# EAGLE design 4ButtonSwitch.Rev1 (EAGLE 8.6.0)
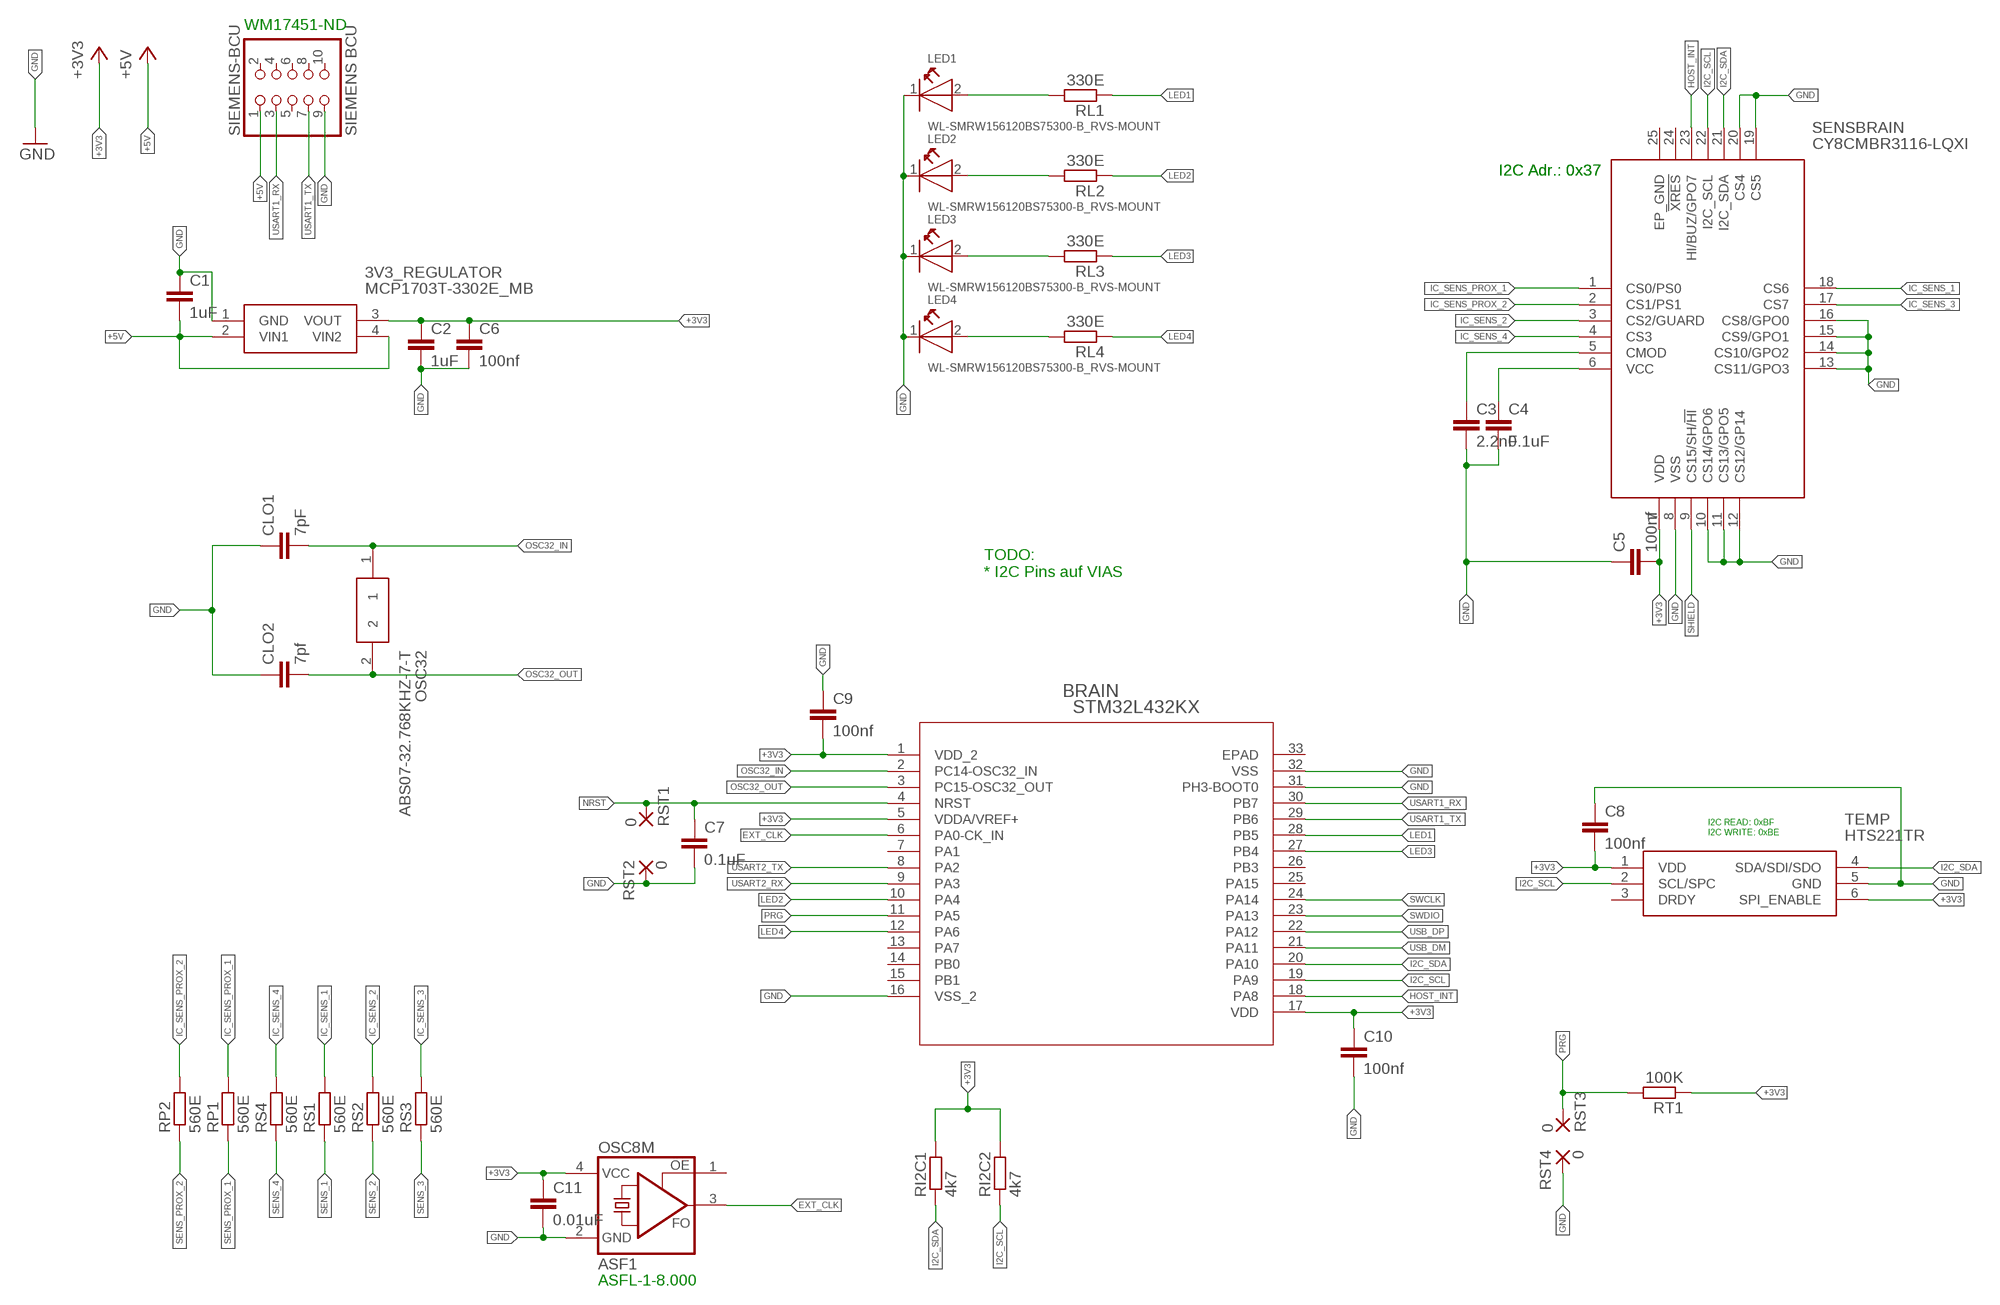
[diagram p0: schematic, sheet 1]

## Parts
3V3_REGULATOR  MCP1703T-3302E_MB  [SOT-89(MB)]
BRAIN  STM32L432KX  [UFQFPN32-5X5MM]
C1  1uF  C-EUC0402  [C0402]
C2  1uF  C-EUC0402  [C0402]
C3  2.2nF  C-EUC0402  [C0402]
C4  0.1uF  C-EUC0402  [C0402]
C5  100nf  C-EUC0402  [C0402]
C6  100nf  C-EUC0402  [C0402]
C7  0.1uF  C-EUC0402  [C0402]
C8  100nf  C-EUC0402  [C0402]
C9  100nf  C-EUC0402  [C0402]
C10  100nf  C-EUC0402  [C0402]
C11  0.01uF  C-EUC0402  [C0402]
CLO1  7pF  C-EUC0402  [C0402]
CLO2  7pf  C-EUC0402  [C0402]
LED1  WL-SMRW156120BS75300-B_RVS-MOUNT  [WL-SMRW-1206-CYLDR-REVERSE-MOUNT]
LED2  WL-SMRW156120BS75300-B_RVS-MOUNT  [WL-SMRW-1206-CYLDR-REVERSE-MOUNT]
LED3  WL-SMRW156120BS75300-B_RVS-MOUNT  [WL-SMRW-1206-CYLDR-REVERSE-MOUNT]
LED4  WL-SMRW156120BS75300-B_RVS-MOUNT  [WL-SMRW-1206-CYLDR-REVERSE-MOUNT]
OSC8M  ASF1  [ASF]
OSC32  ABS07-32.768KHZ-7-T  [ABS-07]
RI2C1  4k7  R-EU_R0402  [R0402]
RI2C2  4k7  R-EU_R0402  [R0402]
RL1  330E  R-EU_R0402  [R0402]
RL2  330E  R-EU_R0402  [R0402]
RL3  330E  R-EU_R0402  [R0402]
RL4  330E  R-EU_R0402  [R0402]
RP1  560E  R-EU_R0402  [R0402]
RP2  560E  R-EU_R0402  [R0402]
RS1  560E  R-EU_R0402  [R0402]
RS2  560E  R-EU_R0402  [R0402]
RS3  560E  R-EU_R0402  [R0402]
RS4  560E  R-EU_R0402  [R0402]
RST1  0  SMD5  [SMD2,54-5,08]
RST2  0  SMD5  [SMD2,54-5,08]
RST3  0  SMD5  [SMD2,54-5,08]
RST4  0  SMD5  [SMD2,54-5,08]
RT1  100K  R-EU_R0402  [R0402]
SENSBRAIN  CY8CMBR3116-LQXI  [QFN50P400X400X60-25N]
SIEMENS-BCU  SIEMENS BCU  PINHD-2X5_2.54-SMD  [2X05SMD]
TEMP  HTS221TR  [HLGA-6L]

## Nets
+3V3: 3V3_REGULATOR.3(VOUT) BRAIN.1(VDD_2) BRAIN.5(VDDA/VREF+) BRAIN.17(VDD) C2.1 C5.2 C6.1 C8.2 C9.2 C10.1 C11.1 OSC8M.4(VCC) RI2C1.2 RI2C2.2 RT1.1 SENSBRAIN.7(VDD) TEMP.1(VDD) TEMP.6(SPI_ENABLE)
+5V: 3V3_REGULATOR.2(VIN1) 3V3_REGULATOR.4(VIN2) C1.2 SIEMENS-BCU.1
CMOD: C3.1 SENSBRAIN.5(CMOD)
EXT_CLK: BRAIN.6(PA0-CK_IN) OSC8M.3(FO)
GND: 3V3_REGULATOR.1(GND) BRAIN.16(VSS_2) BRAIN.31(PH3-BOOT0) BRAIN.32(VSS) C1.1 C2.2 C3.2 C4.2 C5.1 C6.2 C7.2 C8.1 C9.1 C10.2 C11.2 CLO1.1 CLO2.1 LED1.1(K) LED2.1(K) LED3.1(K) LED4.1(K) OSC8M.2(GND) RST2.1(P) RST4.1(P) SENSBRAIN.8(VSS) SENSBRAIN.10(CS14/GPO6) SENSBRAIN.11(CS13/GPO5) SENSBRAIN.12(CS12/GP14) SENSBRAIN.13(CS11/GPO3) SENSBRAIN.14(CS10/GPO2) SENSBRAIN.15(CS9/GPO1) SENSBRAIN.16(CS8/GPO0) SENSBRAIN.19(CS5) SENSBRAIN.20(CS4) SIEMENS-BCU.9 TEMP.5(GND)
HOST_INT: BRAIN.18(PA8) SENSBRAIN.23(HI/BUZ/GPO7)
I2C_SCL: BRAIN.19(PA9) RI2C2.1 SENSBRAIN.22(I2C_SCL) TEMP.2(SCL/SPC)
I2C_SDA: BRAIN.20(PA10) RI2C1.1 SENSBRAIN.21(I2C_SDA) TEMP.4(SDA/SDI/SDO)
IC_SENS_1: RS1.2 SENSBRAIN.18(CS6)
IC_SENS_2: RS2.2 SENSBRAIN.3(CS2/GUARD)
IC_SENS_3: RS3.2 SENSBRAIN.17(CS7)
IC_SENS_4: RS4.2 SENSBRAIN.4(CS3)
IC_SENS_PROX_1: RP1.2 SENSBRAIN.1(CS0/PS0)
IC_SENS_PROX_2: RP2.2 SENSBRAIN.2(CS1/PS1)
LED1: BRAIN.28(PB5) RL1.1
LED2: BRAIN.10(PA4) RL2.1
LED3: BRAIN.27(PB4) RL3.1
LED4: BRAIN.12(PA6) RL4.1
N$19: LED1.2(A) RL1.2
N$20: LED2.2(A) RL2.2
N$21: LED3.2(A) RL3.2
N$22: LED4.2(A) RL4.2
NRST: BRAIN.4(NRST) C7.1 RST1.1(P)
OSC32_IN: BRAIN.2(PC14-OSC32_IN) CLO1.2 OSC32.1
OSC32_OUT: BRAIN.3(PC15-OSC32_OUT) CLO2.2 OSC32.2
PRG: BRAIN.11(PA5) RST3.1(P) RT1.2
SENS_1: RS1.1
SENS_2: RS2.1
SENS_3: RS3.1
SENS_4: RS4.1
SENS_PROX_1: RP1.1
SENS_PROX_2: RP2.1
SHIELD: SENSBRAIN.9(CS15/SH/!HI)
SWCLK: BRAIN.24(PA14)
SWDIO: BRAIN.23(PA13)
USART1_RX: BRAIN.30(PB7) SIEMENS-BCU.3
USART1_TX: BRAIN.29(PB6) SIEMENS-BCU.7
USART2_RX: BRAIN.9(PA3)
USART2_TX: BRAIN.8(PA2)
USB_DM: BRAIN.21(PA11)
USB_DP: BRAIN.22(PA12)
VCC: C4.1 SENSBRAIN.6(VCC)
Unconnected: BRAIN.7(PA1) BRAIN.13(PA7) BRAIN.14(PB0) BRAIN.15(PB1) BRAIN.25(PA15) BRAIN.26(PB3) BRAIN.33(EPAD) OSC8M.1(OE) SENSBRAIN.24(!XRES) SIEMENS-BCU.2 SIEMENS-BCU.4 SIEMENS-BCU.5 SIEMENS-BCU.6 SIEMENS-BCU.8 SIEMENS-BCU.10 TEMP.3(DRDY)

## Notes on the sheet
- WM17451-ND
- I2C Adr.: 0x37 | I2C Adr.: 0x37
- TODO:
  * I2C Pins auf VIAS
- I2C READ: 0xBF
  I2C WRITE: 0xBE
- ASFL-1-8.000

## Power pins joined to a net without a drawn wire
EP_GND: SENSBRAIN.25(EP_GND)

## Library data of the parts
3V3_REGULATOR = MCP1703T-3302E_MB:MCP1703T-3302E_MB: LDO Low Iq 250mA 16V 3.3V 2% SOT89 Microchip MCP1703T-3302E/MB, LDO Voltage Regulator, 250mA, 3.3 V 2%, 2.7 16 Vin, 3-Pin SOT-89 Source: Datasheet <http://ww1.microchip.com/downloads/en/DeviceDoc/22049f.pdf>; ALLIED_NUMBER: 70047986; ALLIED_PRICE/STOCK: https://www.alliedelec.com/microchip-technology-inc-mcp1703t-3302e-mb/70047986/; ARROW_PART_NUMBER: MCP1703T-3302E/MB; ARROW_PRICE/STOCK: https://www.arrow.com/en/products/mcp1703t-3302emb/microchip-technology; DESCRIPTION: LDO Low Iq 250mA 16V 3.3V 2% SOT89 Microchip MCP1703T-3302E/MB, LDO Voltage Regulator, 250mA, 3.3 V 2%, 2.7 16 Vin, 3-Pin SOT-89; HEIGHT: mm; MANUFACTURER_NAME: Microchip; MANUFACTURER_PART_NUMBER: MCP1703T-3302E/MB; RS_PART_NUMBER: 9122916; RS_PRICE/STOCK: http://uk.rs-online.com/web/p/products/9122916
BRAIN = STM32L432KC:STM32L432KX; MANUFACTURER_PART_NUMBER: stm32l432kx; VENDOR: ST Microelectronics
C1-C11 CLO1 CLO2 = rcl:C-EU: CAPACITOR, European symbol; SPICEPREFIX: C
LED1-LED4 = Wurth_Elektronik_Optoelectronics_rev15b (1):WL-SMRW: SMD Reverse mount mono-color rectangular Characteristics Small size & thin body for space saving Ideal for narrow space applications Wide viewing angle Low power consumption Industry standard footprint Small package for exceptional brightness To emit light through a small cut-out hole in PCB Compatible with automatic placement machine Applications Front panel indicators LCD backlighting Keypad backlighting Push button backlighting Symbol and switch backlighting General lighting <http://katalog.we-online.de/media/images/eipal/WL-SMRW_pf2.jpg> Details see: http://katalog.we-online.de/en/led/WL-SMRW?m Updated 2015-04-10 2015 (C) Wurth Elektronik
OSC8M = crystal:ASF*: CRYSTAL CLOCK OSCILLATORS 5.0 Vdc or 3.3 Vdc - LOW PROFILE ULTRA MINIATURE CERAMIC SURFACE MOUNT Source: http://www.abracon.com/Oscillators/asf1-L-L1.pdf; OC_FARNELL: unknown; OC_NEWARK: unknown
OSC32 = ABS07-32.768KHZ-7-T:ABS07-32.768KHZ-7-T: ABRACON - ABS07-32.768KHZ-7-T - CRYSTAL, 32.768KHZ, 7PF, SMD Source: Datasheet <https://componentsearchengine.com/Datasheets/2/ABS07-32.768KHZ-7-T.pdf>; ARROW_PART_NUMBER: ABS07-32.768KHZ-7-T; ARROW_PRICE/STOCK: https://www.arrow.com/en/products/abs07-32.768khz-7-t/abracon; DESCRIPTION: ABRACON - ABS07-32.768KHZ-7-T - CRYSTAL, 32.768KHZ, 7PF, SMD; HEIGHT: mm; MANUFACTURER_NAME: ABRACON; MANUFACTURER_PART_NUMBER: ABS07-32.768KHZ-7-T; RS_PART_NUMBER: 1712773P; RS_PRICE/STOCK: http://uk.rs-online.com/web/p/products/1712773P
RI2C1 RI2C2 RL1-RL4 RP1 RP2 RS1-RS4 RT1 = resistor:R-EU_: RESISTOR, European symbol
RST1-RST4 = wirepad:SMD5: SMD PAD
SENSBRAIN = CY8CMBR3116-LQXI:CY8CMBR3116-LQXI: Touch Screen Controllers CapSense Express 16 Buttons Source: Datasheet <http://www.cypress.com/file/46236/download.pdf>; ARROW_PART_NUMBER: CY8CMBR3116-LQXI; ARROW_PRICE/STOCK: https://www.arrow.com/en/products/cy8cmbr3116-lqxi/cypress-semiconductor; DESCRIPTION: Touch Screen Controllers CapSense Express 16 Buttons; HEIGHT: 0.6mm; MANUFACTURER_NAME: Cypress Semiconductor; MANUFACTURER_PART_NUMBER: CY8CMBR3116-LQXI; RS_PART_NUMBER: 1242976P; RS_PRICE/STOCK: http://uk.rs-online.com/web/p/products/1242976P
SIEMENS-BCU = pinhead:PINHD-2X5: PIN HEADER
TEMP = HTS221TR:HTS221TR: Humidity and Temperature Sensor HLGA6 STMicroelectronics HTS221TR Temperature & Humidity Sensor, -40 +120 C, 6-Pin HLGA Source: Datasheet <http://www.st.com/content/ccc/resource/technical/document/datasheet/4d/9a/9c/ad/25/07/42/34/DM00116291.pdf/files/DM00116291.pdf/jcr:content/translations/en.DM00116291.pdf>; ARROW_PART_NUMBER: HTS221TR; ARROW_PRICE/STOCK: https://www.arrow.com/en/products/hts221tr/stmicroelectronics; DESCRIPTION: Humidity and Temperature Sensor HLGA6 STMicroelectronics HTS221TR Temperature & Humidity Sensor, -40 +120 C, 6-Pin HLGA; HEIGHT: mm; MANUFACTURER_NAME: STMicroelectronics; MANUFACTURER_PART_NUMBER: HTS221TR; RS_PART_NUMBER: 1660935; RS_PRICE/STOCK: http://uk.rs-online.com/web/p/products/1660935

## Board
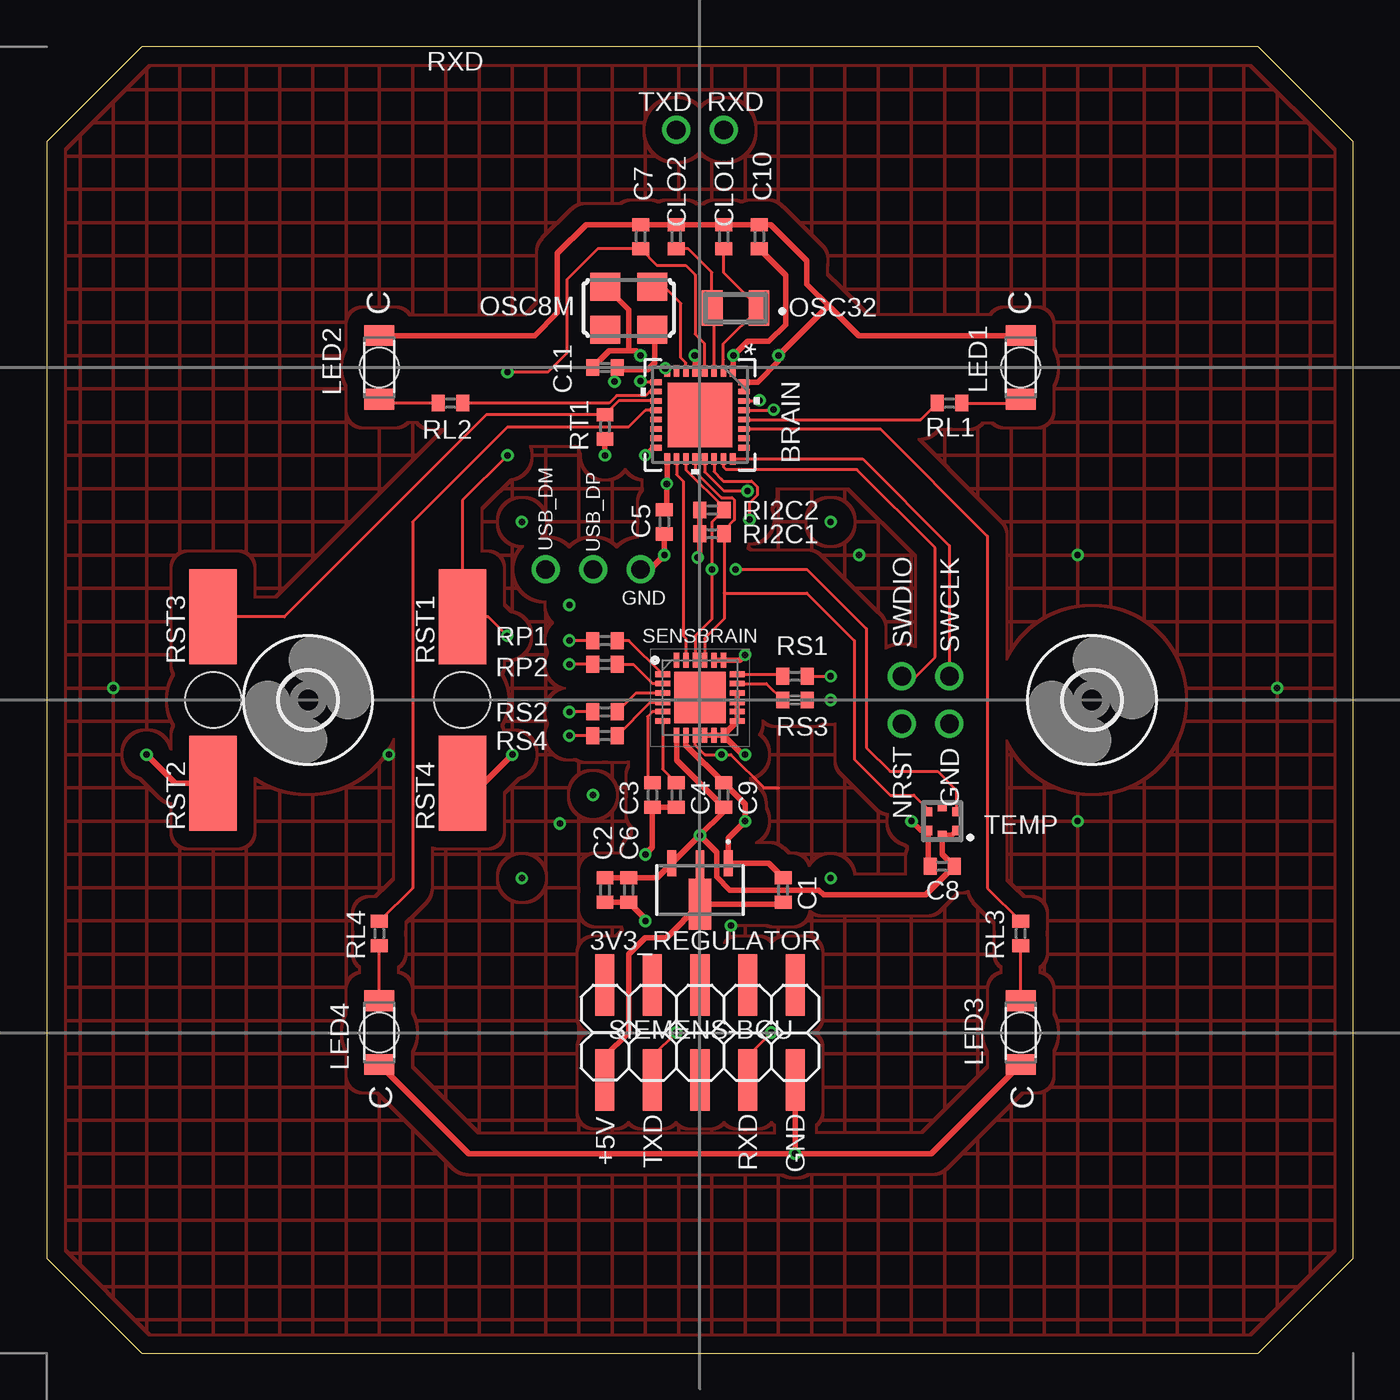
[diagram p1: board, top side]
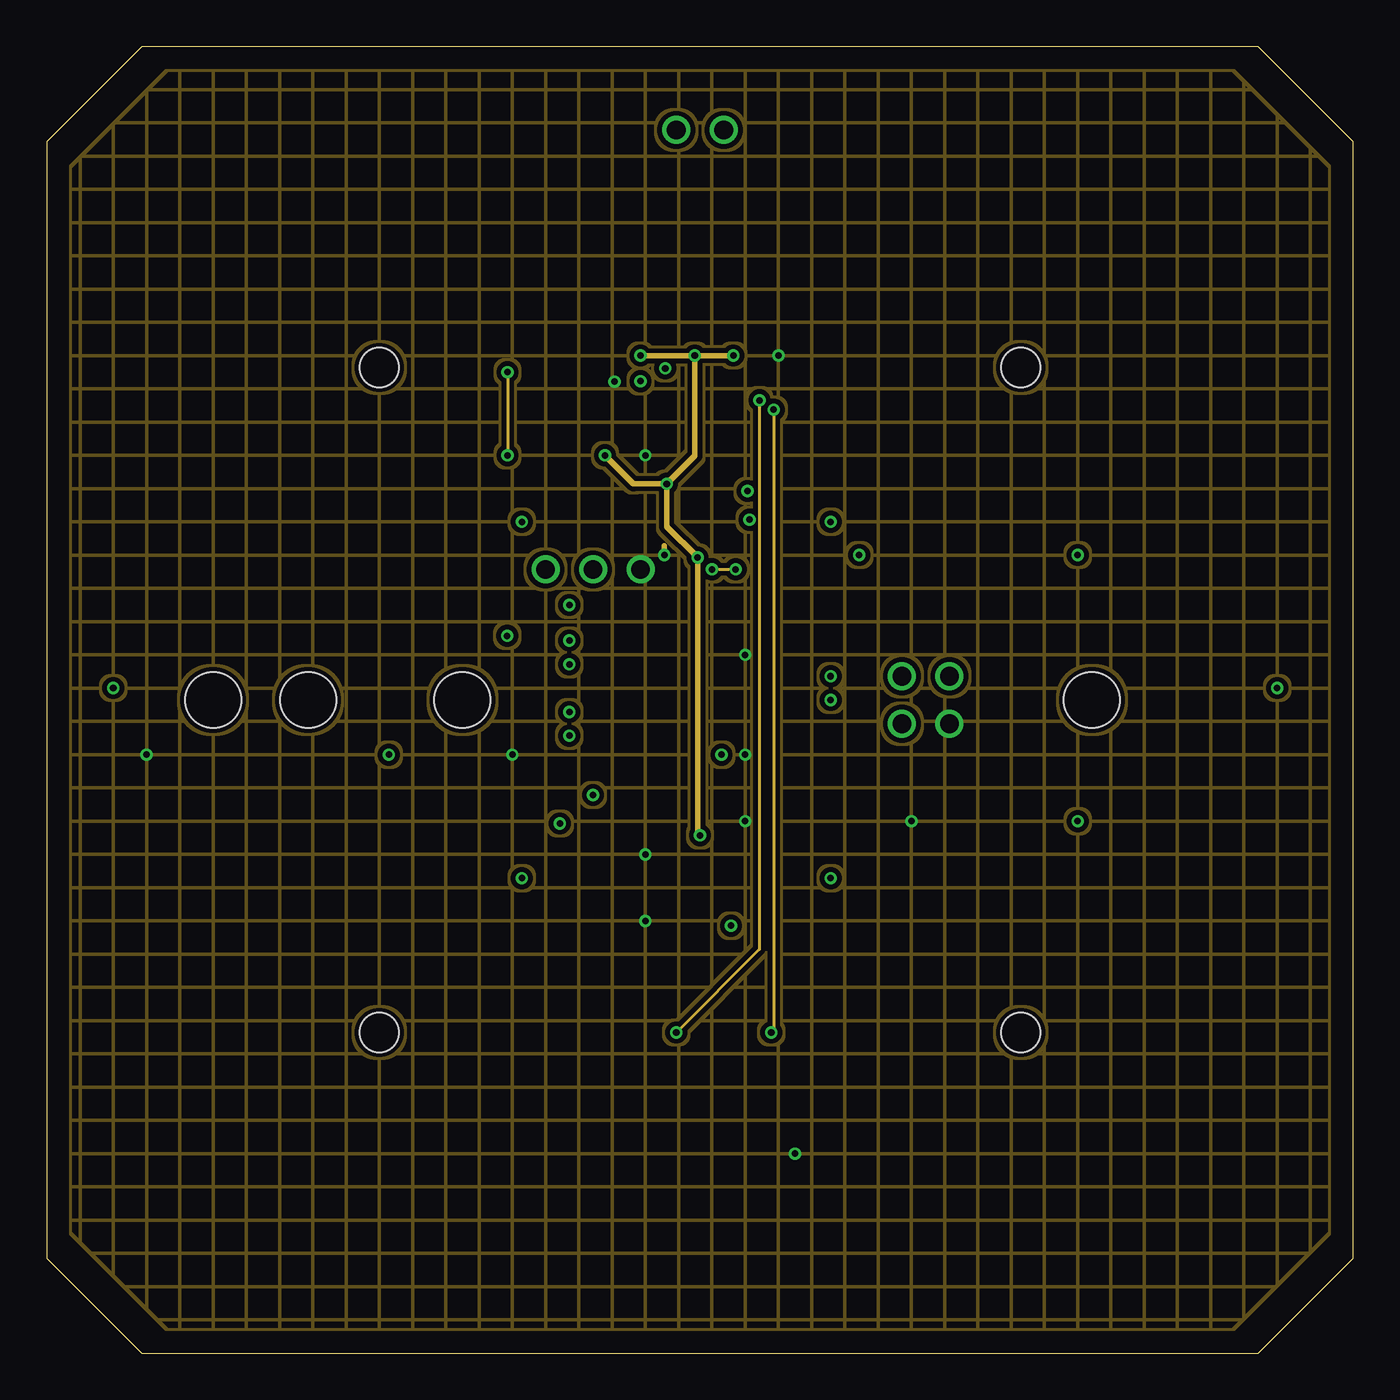
[diagram p2: board, inner layer Route2]
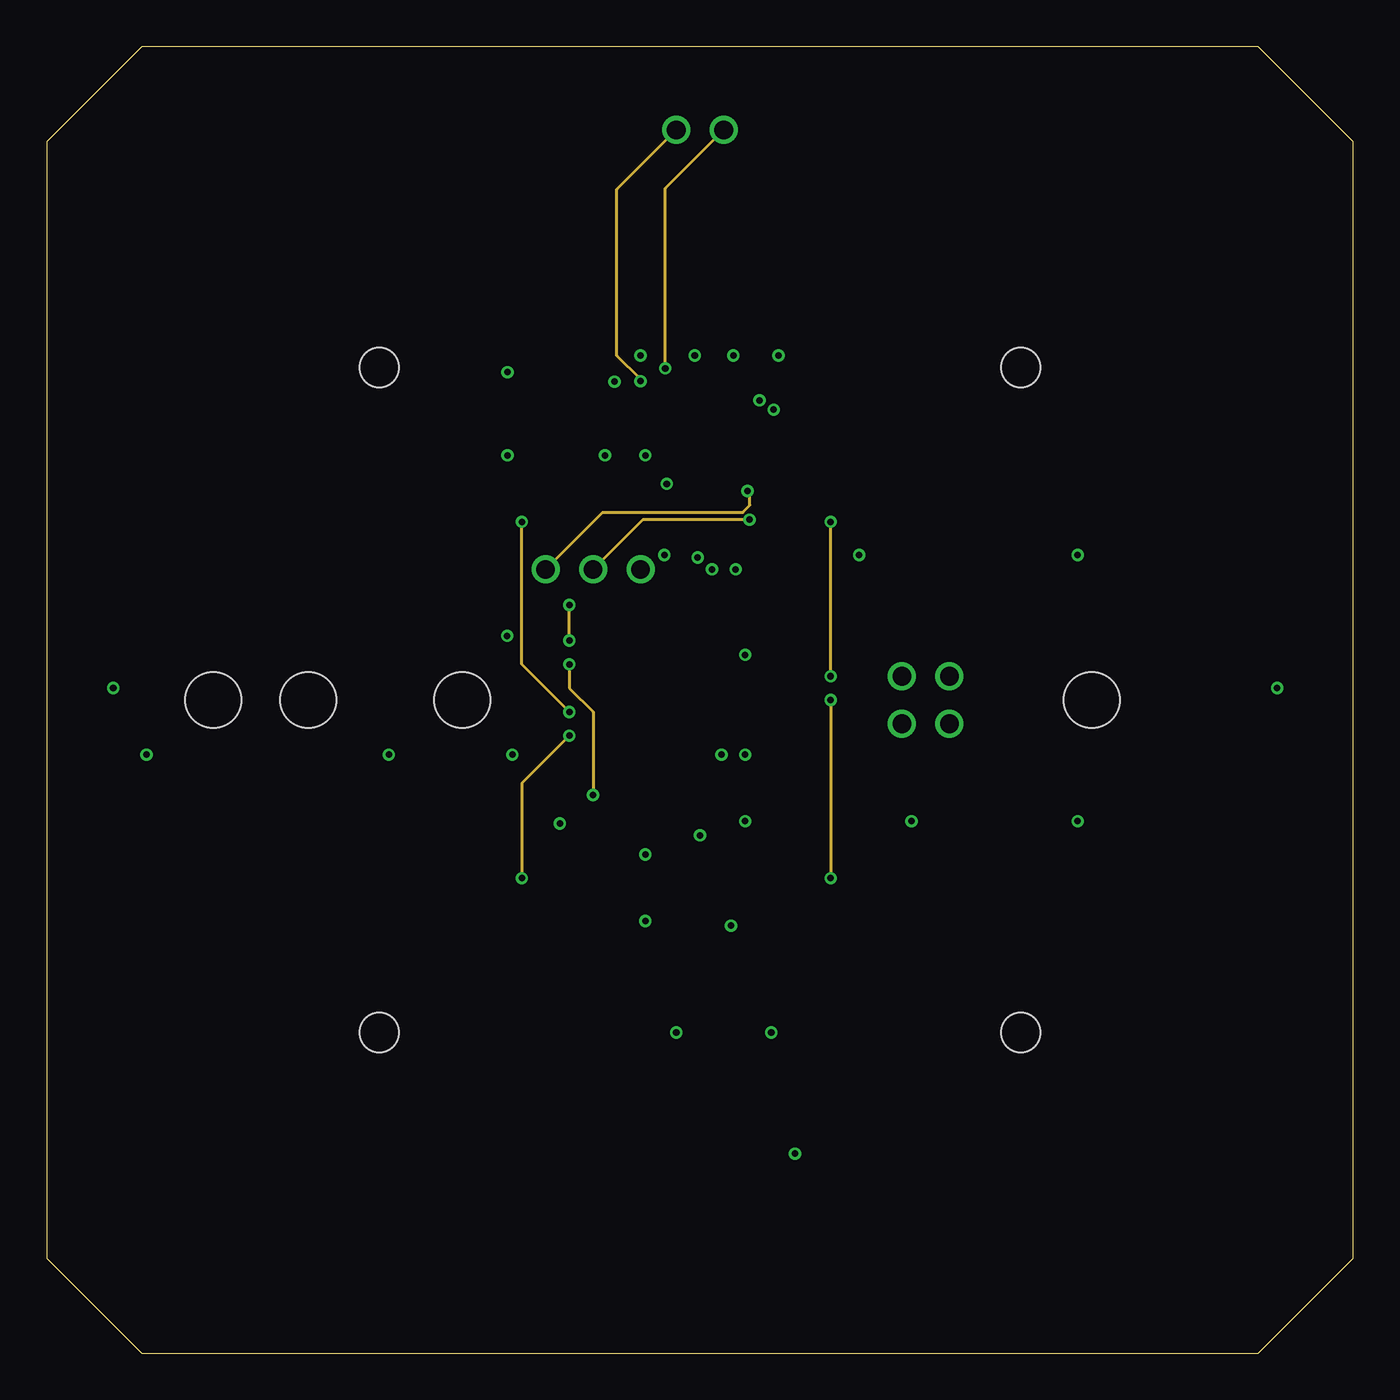
[diagram p3: board, inner layer Route15]
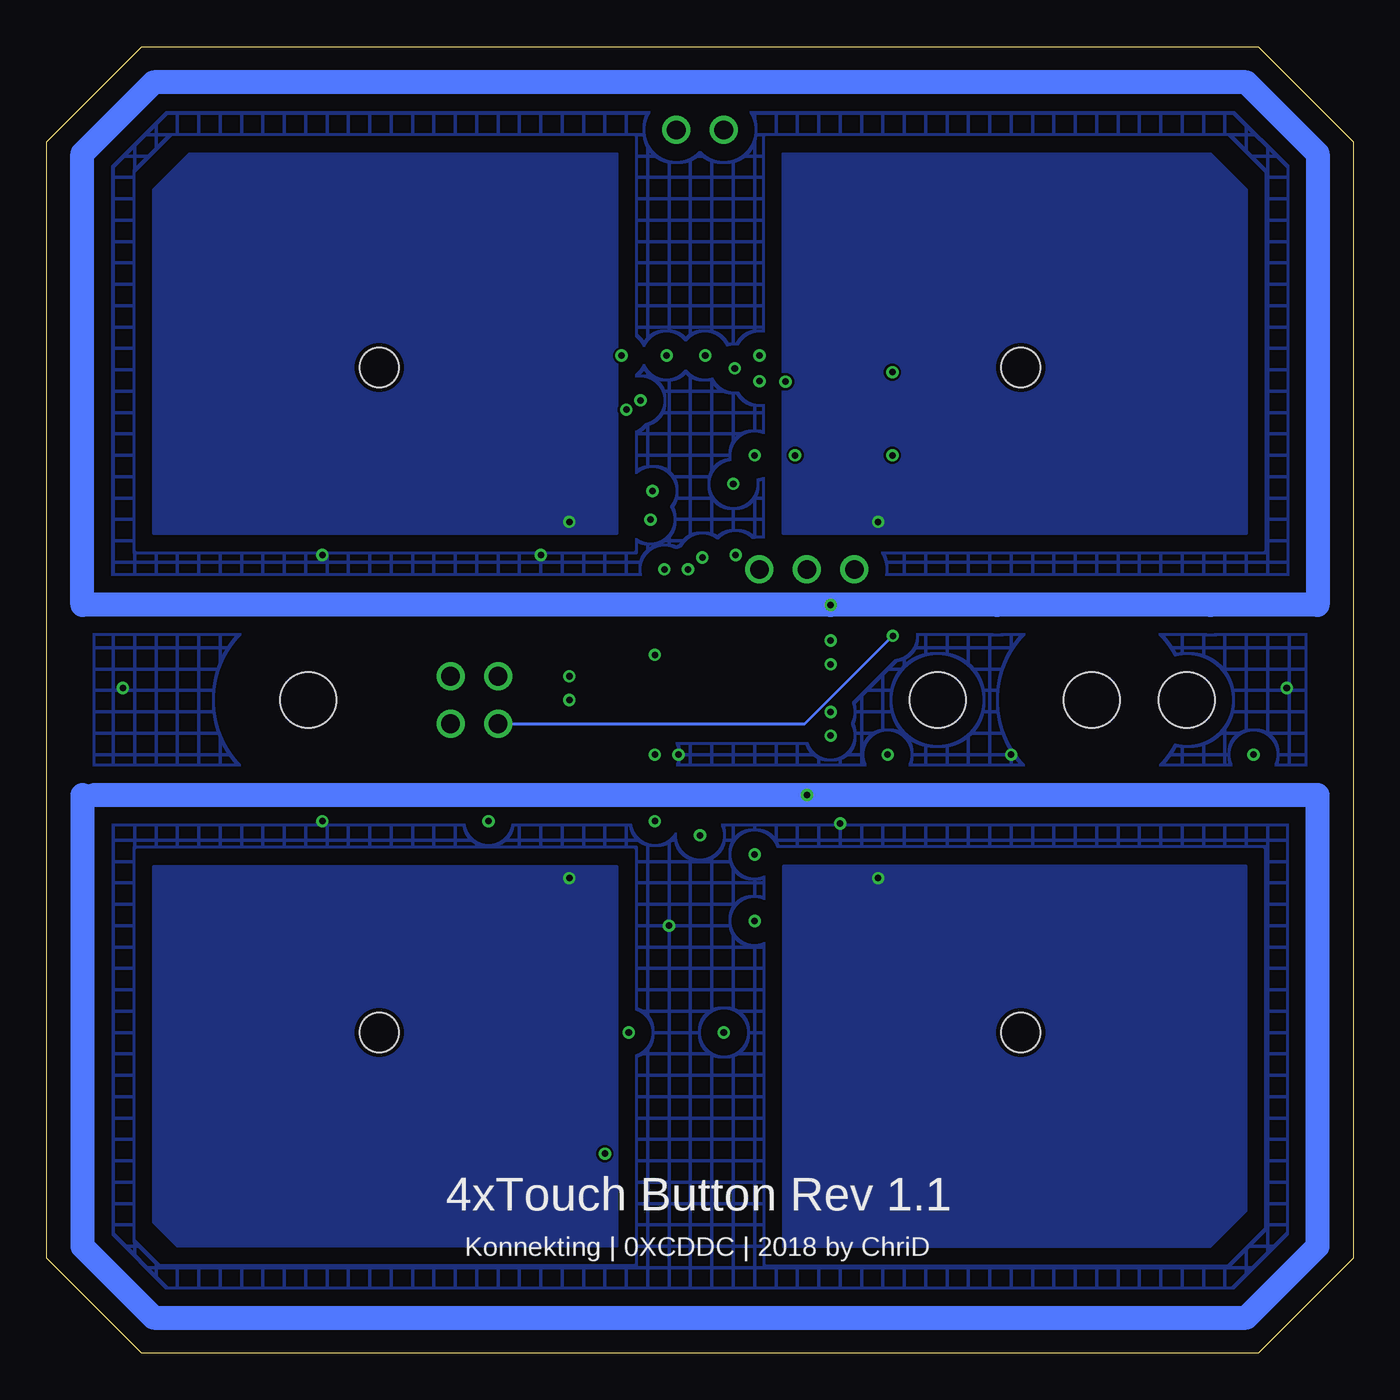
[diagram p4: board, bottom side, seen from below]

Size 69.85 x 69.85 mm. Coordinates in mm from the lower left corner, seen from the top.
Outline: 5.08,69.85 64.77,69.85 69.85,64.77 69.85,5.08 64.77,0 5.08,0 0,5.08 0,64.77 5.08,69.85
Outline: 6.34,69.84 5.08,69.85
Copper layers (1*2*15*16): Top 0.035mm / dielectric 0.23mm / Route2 0.035mm / dielectric 0.93mm / Route15 0.035mm / dielectric 0.23mm / Bottom 0.035mm
Design rules "MF_4_mil_drill_4_Layer": minimum track width 5mil, minimum drill 4mil, track to track 5mil, track to pad 5mil, pad to pad 5mil, via to via 5mil, smd to smd 0mil, copper to edge 10mil, drill to drill 10mil, minimum pad ring 6mil, minimum via ring 6mil, stop-mask expansion 2mil, vias tented up to drill 25mil, thermal gap 10mil
Holes 3 mm at 8.89,34.92 22.23,34.92

### Footprints (pad centres in the part's own frame; a part is rotated, then mirrored left to right if it is on the bottom)
SOT-89(MB) = smd 0.48 x 1.4: 1 -1.5,-1.425; 3 1.5,-1.425 | smd 0.48 x 1.525: 2 0,-1.363 | smd 1.2 x 2.725: 4 0,0.76
UFQFPN32-5X5MM = smd 0.61 x 0.305: 1 -2.35,1.75; 2 -2.35,1.25; 3 -2.35,0.75; 4 -2.35,0.25; 5 -2.35,-0.25; 6 -2.35,-0.75; 7 -2.35,-1.25; 8 -2.35,-1.75; 17 2.35,-1.75; 18 2.35,-1.25; 19 2.35,-0.75; 20 2.35,-0.25; 21 2.35,0.25; 22 2.35,0.75; 23 2.35,1.25; 24 2.35,1.75 | smd 0.305 x 0.61: 9 -1.75,-2.35; 10 -1.25,-2.35; 11 -0.75,-2.35; 12 -0.25,-2.35; 13 0.25,-2.35; 14 0.75,-2.35; 15 1.25,-2.35; 16 1.75,-2.35; 25 1.75,2.35; 26 1.25,2.35; 27 0.75,2.35; 28 0.25,2.35; 29 -0.25,2.35; 30 -0.75,2.35; 31 -1.25,2.35; 32 -1.75,2.35 | smd 3.454 x 3.454: 33 0,0
C0402 = smd 0.7 x 0.9: 1 -0.65,0; 2 0.65,0
WL-SMRW-1206-CYLDR-REVERSE-MOUNT = smd 1.1 x 1.6: 1 -1.7,0; 2 1.7,0 | hole 2.1: 0,0
ASF = smd 1.6 x 1.5: 1 -1.25,-1.15; 2 1.25,-1.15; 3 1.25,1.15; 4 -1.25,1.15
ABS-07 = smd 1.1 x 1.9: 1 -1.25,0; 2 1.25,0
R0402 = smd 0.7 x 0.9: 1 -0.65,0; 2 0.65,0
SMD2,54-5,08 = smd 2.54 x 5.08: 1 0,0
QFN50P400X400X60-25N = smd 0.8 x 0.3: 1 -2,1.25; 2 -2,0.75; 3 -2,0.25; 4 -2,-0.25; 5 -2,-0.75; 6 -2,-1.25; 13 2,-1.25; 14 2,-0.75; 15 2,-0.25; 16 2,0.25; 17 2,0.75; 18 2,1.25 | smd 0.3 x 0.8: 7 -1.25,-2; 8 -0.75,-2; 9 -0.25,-2; 10 0.25,-2; 11 0.75,-2; 12 1.25,-2; 19 1.25,2; 20 0.75,2; 21 0.25,2; 22 -0.25,2; 23 -0.75,2; 24 -1.25,2 | smd 2.75 x 2.75: 25 0,0
2X05SMD = smd 1.016 x 3.302: 1 -1.27,-3.81; 2 -1.27,1.27; 3 1.27,-3.81; 4 1.27,1.27; 5 3.81,-3.81; 6 3.81,1.27; 7 6.35,-3.81; 8 6.35,1.27; 9 8.89,-3.81; 10 8.89,1.27
HLGA-6L = smd 0.45 x 0.5: 1 -0.75,0.5; 2 -0.75,-0.5; 4 0.75,-0.5; 5 0.75,0.5 | smd 0.5 x 0.45: 3 0,-0.75; 6 0,0.75
3,0 = hole 3: 0,0

### Placement (x,y rotation side)
3V3_REGULATOR  34.92,24.77 180 top
BRAIN  34.92,50.16 270 top
C1  39.37,24.77 270 top
C2  29.84,24.77 270 top
C3  32.38,29.84 270 top
C4  33.66,29.84 270 top
C5  33.02,44.45 90 top
C6  31.11,24.77 270 top
C7  31.75,59.69 90 top
C8  47.88,26.04 0 top
C9  36.2,29.84 270 top
C10  38.1,59.69 90 top
C11  29.84,52.7 0 top
CLO1  36.2,59.69 270 top
CLO2  33.66,59.69 270 top
LED1  52.07,52.7 270 top
LED2  17.78,52.7 270 top
LED3  52.07,17.14 90 top
LED4  17.78,17.14 90 top
OSC8M  31.11,55.88 0 top
OSC32  36.83,55.88 180 top
RI2C1  35.56,43.81 180 top
RI2C2  35.56,45.09 180 top
RL1  48.26,50.8 0 top
RL2  21.59,50.8 180 top
RL3  52.07,22.44 270 top
RL4  17.78,22.44 270 top
RP1  29.84,38.1 0 top
RP2  29.84,36.83 0 top
RS1  40.01,36.2 180 top
RS2  29.84,34.29 0 top
RS3  40.01,34.92 180 top
RS4  29.84,33.02 0 top
RST1  22.23,39.37 0 top
RST2  8.89,30.48 0 top
RST3  8.89,39.37 0 top
RST4  22.23,30.48 0 top
RT1  29.84,49.53 90 top
SENSBRAIN  34.92,35.05 0 top
SIEMENS-BCU  31.11,18.41 0 top
TEMP  47.88,28.45 180 top
U$1  [3,0]  13.97,34.92 0 top
U$2  [3,0]  55.88,34.92 0 top

### Tracks (layer width: path | path; a pad name or v marks a point on that pad's centre or on a via)
+3V3  (via drill 0.35)
  Top 0.305: SENSBRAIN.7 33.67,31.71 C9.2 36.2,28.96 v34.92,27.69 | v34.92,27.69 3V3_REGULATOR.3 32.65,25.41 C6.1 C2.1 | BRAIN.5 34.67,53.31 v34.64,53.34 | v33.15,46.48 33.02,46.35 | BRAIN.1 36.71,52.55 v36.71,53.34 37.47,54.1 38.61,54.1 39.5,54.99 39.5,57.64 C10.1 | v33.15,46.48 33.17,46.51 BRAIN.17 | RI2C2.2 RI2C1.2 34.91,42.66 v34.8,42.55 | RT1.1 v29.84,48.01 | C5.2 33.15,45.23 v33.15,46.48 | TEMP.1 48.38,27.7 TEMP.6 47.88,26.68 C8.2 47.01,24.51 41.53,24.51 41.27,24.77 36.52,24.77 35.81,25.47 35.81,26.8 v34.92,27.69 | 29.86,56.67 OSC8M.4 31.11,55.78 31.11,53.59 | v31.75,53.34 31.5,53.59 31.11,53.59 | C11.1 30.08,53.59 31.11,53.59
  Route2 0.305: v34.64,53.34 34.64,47.98 v33.15,46.48 | v36.71,53.34 v34.64,53.34 | v34.92,27.69 34.8,27.81 v34.8,42.55 33.15,44.2 v33.15,46.48 | v29.84,48.01 31.37,46.48 v33.15,46.48 | v31.75,53.34 v34.64,53.34
+5V
  Top 0.152: 3V3_REGULATOR.4 3V3_REGULATOR.2
  Top 0.305: C1.2 39.26,24 3V3_REGULATOR.4 33.15,22.23 32,22.23 31.11,21.34 31.11,17.14 29.84,15.88 SIEMENS-BCU.1
CMOD
  Top 0.152: SENSBRAIN.5 32.38,34.29 32.13,34.04 32.13,30.75 C3.1
EXT_CLK
  Top 0.152: BRAIN.6 34.17,52.95 33.91,53.21 33.91,56.13 33.01,57.03 OSC8M.3
GND  (via drill 0.35, 1)
  Top 0.152: 47.23,27.85 TEMP.5
  Top 0.305: SENSBRAIN.20 SENSBRAIN.19 37.05,37.05 v37.34,37.34 | SENSBRAIN.12 SENSBRAIN.13 SENSBRAIN.14 SENSBRAIN.15 SENSBRAIN.16 | SENSBRAIN.12 SENSBRAIN.11 SENSBRAIN.10 | C1.1 38.59,26.19 3V3_REGULATOR.1 36.42,27.54 v37.34,28.45 37.34,29.35 C9.1 34.17,32.52 SENSBRAIN.8 | C4.2 C3.2 32.38,27.05 v32,26.67 | C2.2 C6.2 32,23.23 v32,23.11 | 40.01,13.34 SIEMENS-BCU.9 v40.01,10.67 | SENSBRAIN.12 37.22,32 v37.34,32 | LED1.1 43.4,54.41 41.92,55.89 | BRAIN.31 BRAIN.32 38,51.91 39.12,53.03 v39.12,53.34 41.66,55.89 41.92,55.89 | RST2.1 6.86,30.48 v5.33,32 | RST4.1 23.37,30.48 v24.89,32 | BRAIN.16 32.41,48.41 v32,48.01 | C5.1 v33.02,42.67 32.26,41.91 v31.75,41.91 | LED3.1 47.29,10.67 v40.01,10.67 | LED4.1 22.56,10.67 v40.01,10.67 | v46.23,28.45 46.73,27.95 TEMP.5 47.13,26.14 C8.1 | 41.92,55.89 40.64,57.16 40.64,58.42 38.72,60.34 C10.2 CLO1.1 CLO2.1 C7.2 30.5,60.34 | 30.48,60.33 30.5,60.34 | C11.2 30.52,52.73 | LED2.1 26.08,54.41 27.3,55.63 27.3,58.8 28.84,60.34 30.5,60.34 | C11.2 30.62,52.58 32.13,52.58 32.51,52.96 32.51,54.58 OSC8M.2 | C11.2 30.35,52.56 v30.35,51.95
  Route2 0.305: v33.02,42.67 33.02,43.18
  other vias: 48.26,33.66
  pour Route2 (isolate 0.254, rank 6, no thermals, hatched): 1.27,63.5 6.35,68.58 63.5,68.58 68.58,63.5 68.58,6.35 63.5,1.27 6.35,1.27 1.27,6.35
HOST_INT
  Top 0.152: BRAIN.18 33.67,46.97 34.04,46.61 34.04,38.35 34.17,38.22 SENSBRAIN.23
I2C_SCL  (via drill 0.35)
  Top 0.152: BRAIN.19 34.17,47.23 36.21,45.2 RI2C2.1 | RI2C2.1 36.21,44.9 | SENSBRAIN.22 34.67,38.35 35.56,39.24 v35.56,41.91 35.56,44.44 RI2C2.1 | v36.83,41.91 40.64,41.91 43.81,38.73 43.81,32.38 45.09,31.11 47.62,31.11 48.63,30.11 TEMP.2
  Route2 0.152: v35.56,41.91 v36.83,41.91
I2C_SDA
  Top 0.152: BRAIN.20 34.67,47.13 36.06,45.74 36.64,45.74 36.76,45.62 36.76,44.55 36.21,44 RI2C1.1 36.21,40.64 | 36.21,40.64 36.21,39.26 35.17,38.22 SENSBRAIN.21 | 36.21,40.64 40.64,40.64 43.18,38.1 43.18,31.75 45.09,29.84 46.35,29.84 47.13,29.07 TEMP.4
IC_SENS_1
  Top 0.152: SENSBRAIN.18 39.25,36.3 RS1.2
IC_SENS_2
  Top 0.152: RS2.2 31.51,35.3 SENSBRAIN.3
IC_SENS_3
  Top 0.152: SENSBRAIN.17 38.48,35.8 RS3.2
IC_SENS_4
  Top 0.152: RS4.2 32.28,34.8 SENSBRAIN.4
IC_SENS_PROX_1
  Top 0.152: SENSBRAIN.1 31.13,38.1 RP1.2
IC_SENS_PROX_2
  Top 0.152: SENSBRAIN.2 32.4,35.8 31.37,36.83 RP2.2
LED1
  Top 0.152: BRAIN.28 46.73,49.91 RL1.1
LED2
  Top 0.152: BRAIN.10 32.24,51.41 32.02,51.2 30.46,51.2 30.07,50.8 RL2.1
LED3
  Top 0.152: 51.84,23.09 RL3.1 50.29,24.87 50.29,43.69 44.56,49.41 BRAIN.27
LED4
  Top 0.152: BRAIN.12 32,50.41 31.11,49.53 24.64,49.53 19.56,44.45 19.56,24.87 RL4.1
N$19
  Top 0.152: RL1.2 51.87,50.8 LED1.2
N$20
  Top 0.152: RL2.2 17.98,50.8 LED2.2
N$21
  Top 0.152: LED3.2 RL3.2
N$22
  Top 0.152: LED4.2 RL4.2
NRST  (via drill 0.35, 1)
  Top 0.152: v24.64,48.01 22.23,45.59 RST1.1 23.6,39.37 v24.61,38.35 | BRAIN.4 35.17,53.98 34.67,54.48 34.67,57.66 34.16,58.17 32.62,58.17 C7.1 29.45,59.04 27.81,57.4 27.81,53.47 26.8,52.45 v24.64,52.45
  Route2 0.152: v24.64,52.45 v24.64,48.01
  Bottom 0.152: v24.61,38.35 28.15,34.82 28.16,34.82 29.32,33.66 v45.72,33.66
OSC32_IN
  Top 0.152: BRAIN.2 36.17,53.12 | 36.17,53.12 | 36.17,53.12 36.17,53.98 OSC32.1 | OSC32.1 38.08,56.52 | OSC32.1 36.2,57.77 CLO1.2
OSC32_OUT
  Top 0.152: BRAIN.3 35.67,55.78 OSC32.2 | OSC32.2 35.58,56.48 | OSC32.2 35.56,55.9 35.56,57.78 34.3,59.04 CLO2.2
PRG
  Top 0.152: BRAIN.11 30.58,50.91 RT1.2 29.83,50.16 23.5,50.16 12.7,39.37 RST3.1
SENS_1  (via drill 0.35)
  Top 0.152: RS1.1 v41.91,36.2
  Route15 0.152: v41.91,36.2 v41.91,44.45
  pour Bottom: 39.37,43.81 64.14,43.81 64.14,62.23 62.23,64.14 39.37,64.14
SENS_2  (via drill 0.35)
  Top 0.152: RS2.1 v27.94,34.29
  Route15 0.152: v27.94,34.29 25.4,36.83 v25.4,44.45
  pour Bottom: 5.71,62.23 5.71,43.81 30.48,43.81 30.48,64.14 7.62,64.14
SENS_3  (via drill 0.35)
  Top 0.152: RS3.1 v41.91,34.92
  Route15 0.152: v41.91,34.92 v41.91,25.4
  pour Bottom: 39.37,5.71 62.87,5.71 64.14,6.99 64.14,26.04 39.37,26.04
SENS_4  (via drill 0.35)
  Top 0.152: RS4.1 v27.94,33.02
  Route15 0.152: v27.94,33.02 25.4,30.48 v25.4,25.4
  pour Bottom: 5.71,26.04 30.48,26.04 30.48,5.71 7.62,5.71 5.71,7.62
SENS_PROX_1  (via drill 0.35)
  Top 0.152: RP1.1 v27.94,38.1
  Route15 0.152: v27.94,38.1 v27.94,40.01
  Bottom 0.152: 19.05,40.01 18.99,39.94 19.05,39.88
  Bottom 1.27: 5.71,67.94 64.14,67.94 67.94,64.14 67.94,40.01 v27.94,40.01 19.05,40.01 7.62,40.01 1.91,40.01 1.91,64.14 5.71,67.94
SENS_PROX_2  (via drill 0.35)
  Top 0.152: RP2.1 v27.94,36.83
  Route15 0.152: v27.94,36.83 27.94,35.56 29.21,34.29 v29.21,29.84
  Bottom 1.27: 67.31,29.84 v29.21,29.84 1.91,29.84 1.91,5.71 5.71,1.91 64.14,1.91 67.94,5.71 67.94,29.84
SHIELD  (via drill 0.35)
  Top 0.152: SENSBRAIN.9 34.67,32.52 35.19,32 v36.07,32 36.58,32 38.35,30.23 39.12,30.23
  other vias: 18.29,32 55.12,28.45 55.12,42.67 27.43,28.32 43.43,42.67 65.79,35.56 3.56,35.56 36.58,22.86
  pour Bottom (isolate 0.889, rank 6, no thermals, hatched): 2.54,6.35 6.35,2.54 63.5,2.54 67.31,6.35 67.31,63.5 64.77,66.04 64.77,67.31 6.35,67.31 2.54,63.5
  pour Top (isolate 0.889, rank 6, no thermals, hatched): 0.64,5.08 5.08,0.64 64.77,0.64 69.22,5.08 69.22,64.77 64.77,69.22 5.08,69.22 0.64,64.77
SWCLK  (via drill 1)
  Top 0.152: BRAIN.24 43.62,47.81 48.26,43.18 v48.26,36.2
SWDIO  (via drill 1)
  Top 0.152: BRAIN.23 36.17,47.39 36.32,47.24 43.31,47.24 47.5,43.05 47.5,37.21 46.48,36.2 v45.72,36.2
USART1_RX  (via drill 0.35)
  Top 0.152: v38.1,50.95 38.07,50.91 BRAIN.30 | v33.66,17.14 32.38,15.88
  Top 0.305: 32.38,15.88 SIEMENS-BCU.3
  Route2 0.152: v38.1,50.95 38.1,21.59 v33.66,17.14
USART1_TX  (via drill 0.35)
  Top 0.152: v38.86,50.45 38.83,50.41 BRAIN.29 | v38.73,17.14 37.47,15.88
  Top 0.305: 37.47,15.88 SIEMENS-BCU.7
  Route2 0.152: v38.86,50.45 38.86,17.27
  Route2 0.305: 38.86,17.27 v38.73,17.14
USART2_RX  (via drill 0.35, 1)
  Top 0.152: BRAIN.9 31.81,51.91 v31.75,51.97
  Route15 0.152: v31.75,51.97 31.75,52.07 30.48,53.34 30.48,62.23 v33.66,65.41
USART2_TX  (via drill 0.35, 1)
  Top 0.152: BRAIN.8 33.07,52.62 v33.07,52.66
  Route15 0.152: v33.07,52.66 33.07,62.28 v36.2,65.41
USB_DM  (via drill 0.35, 1)
  Top 0.152: BRAIN.21 35.17,47.12 36.2,46.1 v37.47,46.1
  Route15 0.152: v37.47,46.1 37.59,45.97 37.59,45.34 37.21,44.96 29.72,44.96 v26.67,41.91
USB_DP  (via drill 0.35, 1)
  Top 0.152: BRAIN.22 35.67,47.13 35.69,47.12 36.07,46.74 36.17,46.63 37.69,46.63 38,46.32 38,45.88 37.57,45.45 v37.57,44.57
  Route15 0.152: v37.57,44.57 31.87,44.57 v29.21,41.91
VCC
  Top 0.152: SENSBRAIN.6 32.92,31.23 C4.1

### Text on the board
tNames: RXD | TXD | RXD | USB_DM | USB_DP | GND | SWDIO | SWCLK | NRST | GND | +5V | TXD | RXD | GND
bNames: 4xTouch Button Rev 1.1 | Konnekting | 0XCDDC | 2018 by ChriD